# Altium schematic sheet MCU.SchDoc
size A3
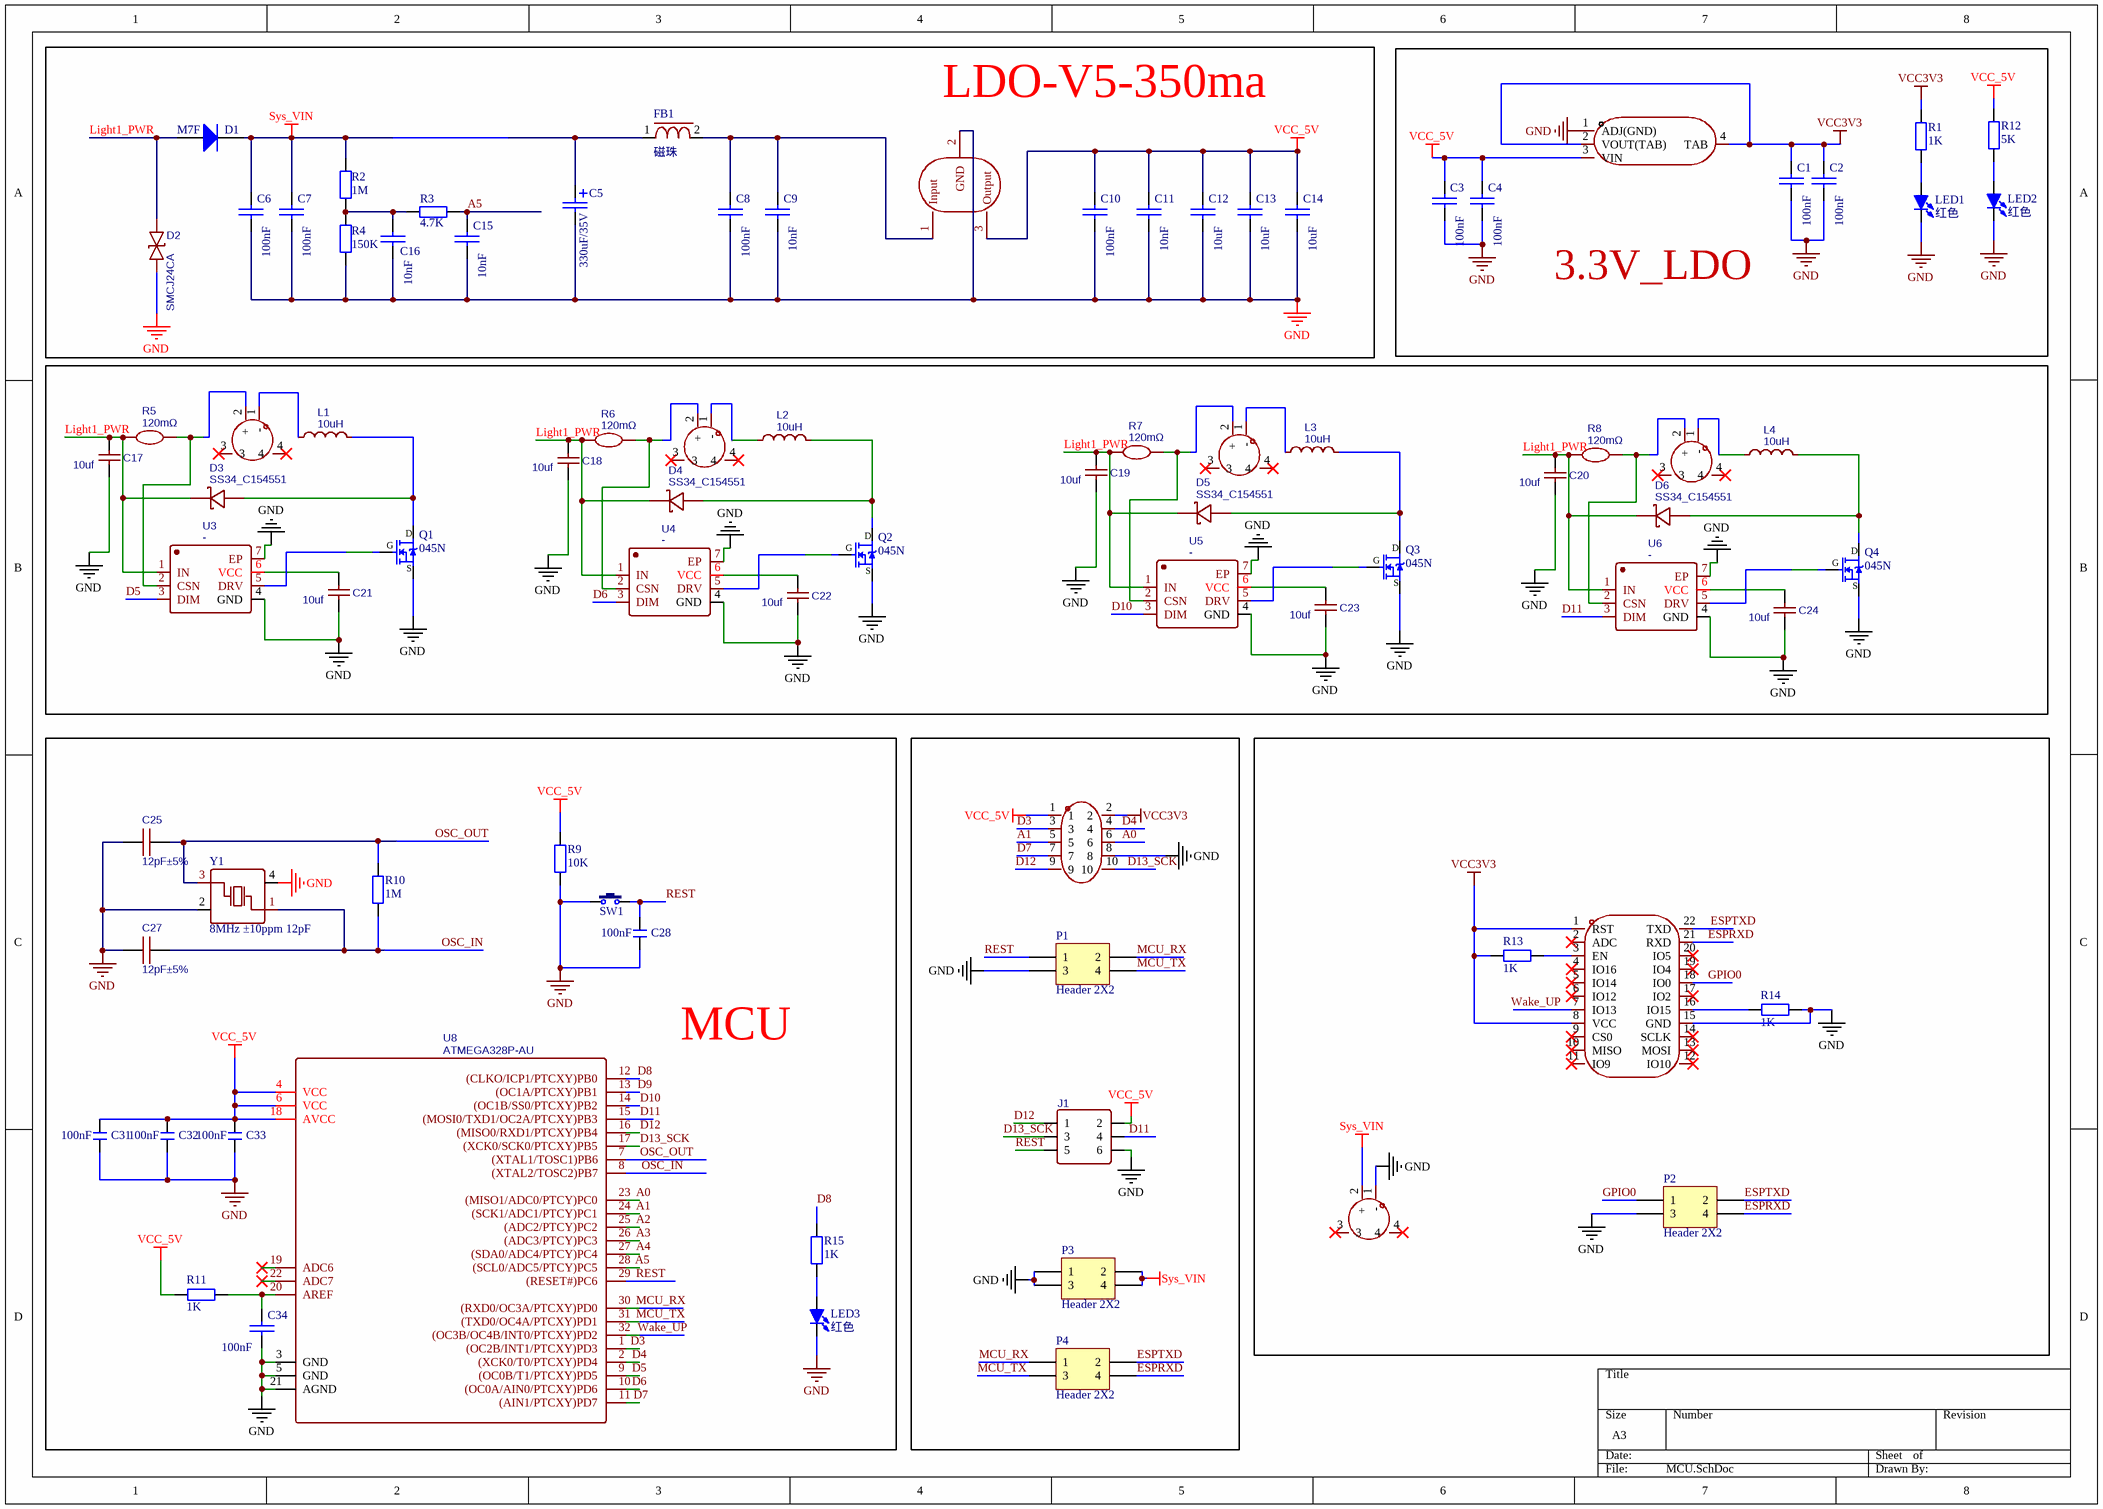
[diagram p0: MCU.SchDoc]

## Parts
C1  100nF  [C_0603]
C2  100nF  [C_0603]
C3  100nF  [C_0603]
C4  100nF  [C_0603]
C5  330uF/35V  [9*H11MM]
C6  100nF  [C_0603]
C7  100nF  [C_0603]
C8  100nF  [C_0603]
C9  10nF  [C_0603]
C10  100nF  [C_0603]
C11  10nF  [C_0603]
C12  10uF  [C_1206]
C13  10uF  [C_1206]
C14  10uF  [C_1206]
C15  10nF  [C_0603]
C16  10nF  [C_0603]
C17  10uf  [C_0603]
C18  10uf  [C_0603]
C19  10uf  [C_0603]
C20  10uf  [C_0603]
C21  10uf  [C_0603]
C22  10uf  [C_0603]
C23  10uf  [C_0603]
C24  10uf  [C_0603]
C25  12pF±5%  [C_0603]
C27  12pF±5%  [C_0603]
C28  100nF  [C_0603]
C31  100nF  [C_0603]
C32  100nF  [C_0603]
C33  100nF  [C_0603]
C34  100nF  [C_0603]
CN1  XT60PW-M  [CONN-TH_XT60PW-M - duplicate]  (value not drawn)
CN2  XT60PW-M  [CONN-TH_XT60PW-M - duplicate]  (value not drawn)
CN3  XT60PW-M  [CONN-TH_XT60PW-M - duplicate]  (value not drawn)
CN4  XT60PW-M  [CONN-TH_XT60PW-M - duplicate]  (value not drawn)
CN5  JL15EDGRHC-35005B02  [CONN-TH_5P-P3.50_JILN_JL15EDGRHC-35005B02]  (value not drawn)
CN6  XT60PW-M  [CONN-TH_XT60PW-M - duplicate]  (value not drawn)
D1  M7F  [SMA]
D2  SMCJ24CA  [SMC]
D3  SS34_C154551  [SMC]
D4  SS34_C154551  [SMC]
D5  SS34_C154551  [SMC]
D6  SS34_C154551  [SMC]
FB1  磁珠  [R_0805]
J1  HDR-M-2.54_2x3  [HDR-3X2]  (value not drawn)
L1  10uH  [IND-SMD_L7.0-W6.6_FXL0650]
L2  10uH  [IND-SMD_L7.0-W6.6_FXL0650]
L3  10uH  [IND-SMD_L7.0-W6.6_FXL0650]
L4  10uH  [IND-SMD_L7.0-W6.6_FXL0650]
LED1  红色  [LED 0805G]
LED2  红色  [LED 0805G]
LED3  红色  [LED 0805G]
P1  Header 2X2  [HDR-2X2]
P2  Header 2X2  [HDR-2X2]
P3  Header 2X2  [HDR-2X2]
P4  Header 2X2  [HDR-2X2]
Q1  045N  [TDSON-8_L5.9-W5.2-P1.27-BL]
Q2  045N  [TDSON-8_L5.9-W5.2-P1.27-BL]
Q3  045N  [TDSON-8_L5.9-W5.2-P1.27-BL]
Q4  045N  [TDSON-8_L5.9-W5.2-P1.27-BL]
R1  1K  [R_0603]
R2  1M  [R_0603]
R3  4.7K  [R_0603]
R4  150K  [R_0603]
R5  120mΩ  [R 2512-HP]
R6  120mΩ  [R 2512-HP]
R7  120mΩ  [R 2512-HP]
R8  120mΩ  [R 2512-HP]
R9  10K  [R_0603]
R10  1M  [R_0603]
R11  1K  [R_0603]
R12  5K  [R_0603]
R13  1K  [R_0603]
R14  1K  [R_0603]
R15  1K  [R_0603]
SW1  3x6x5  [TSW SMD-3*6*2.5]  (value not drawn)
U1  AMS1117-3.3  [SOT223_L]  (value not drawn)
U2  DIA7875B50TA3  [SOT223_N]  (value not drawn)
U3  -  [TDFN-6_L3.0-W3.0-P0.95-BL-EP]
U4  -  [TDFN-6_L3.0-W3.0-P0.95-BL-EP]
U5  -  [TDFN-6_L3.0-W3.0-P0.95-BL-EP]
U6  -  [TDFN-6_L3.0-W3.0-P0.95-BL-EP]
U7  2.4GHz  [WIRELM-SMD_ESP-12F]  (value not drawn)
U8  ATMEGA328P-AU  [TQFP-32_L7.0-W7.0-P0.80-LS9.0-BL]
Y1  8MHz ±10ppm 12pF  [SMD-3225-4P]

## Blocks framed on the sheet
LDO-V5-350ma: C5-C16 D1 D2 FB1 R2-R4 U2
3.3V_LDO: C1-C4 LED1 LED2 R1 R12 U1
MCU: C25 C27 C28 C31-C34 LED3 R9-R11 R15 SW1 U8 Y1

## Nets
GND: C1.2 C2.2 C3.2 C4.2 C5.2 C6.2 C7.2 C8.2 C9.2 C10.2 C11.2 C12.2 C13.2 C14.2 C15.2 C16.2 C17.1 C18.1 C19.1 C20.1 C21.1 C22.1 C23.1 C24.1 C25.1(A) C27.1(A) C28.1 C31.1 C32.1 C33.1 C34.2 CN5.8 CN6.1(-) D2.2 J1.6 LED1.2(K) LED2.2(K) LED3.2(K) P1.3 P2.3 P3.1 P3.3 Q1.3(D) Q2.3(D) Q3.3(D) Q4.3(D) R4.1 R9.1 R14.1 SW1.1 U1.1(ADJ(GND)) U2.2(GND) U3.4(GND) U3.7(EP) U4.4(GND) U4.7(EP) U5.4(GND) U5.7(EP) U6.4(GND) U6.7(EP) U7.15(GND) U8.3(GND) U8.5(GND) U8.21(AGND) Y1.2(GND) Y1.4(GND)
Sys_VIN: C5.1 C6.1 C7.1 CN6.2(+) D1.2(K) FB1.1 P3.2 P3.4 R2.2
VCC3V3: C1.1 C2.1 CN5.2 R1.2 R13.2 U1.2(VOUT(TAB)) U1.4(TAB) U7.1(RST) U7.8(VCC)
VCC_5V: C3.1 C4.1 C10.1 C11.1 C12.1 C13.1 C14.1 C31.2 C32.2 C33.2 CN5.1 J1.2 R9.2 R11.2 R12.2 U1.3(VIN) U2.3(Output) U8.4(VCC) U8.6(VCC) U8.18(AVCC)
A0: CN5.6 U8.23((MISO1/ADC0/PTCY)PC0)
A1: CN5.5 U8.24((SCK1/ADC1/PTCY)PC1)
A2: U8.25((ADC2/PTCY)PC2)
A3: U8.26((ADC3/PTCY)PC3)
A4: U8.27((SDA0/ADC4/PTCY)PC4)
A5: C15.1 R3.1 U8.28((SCL0/ADC5/PTCY)PC5)
D3: CN5.3 U8.1((OC2B/INT1/PTCXY)PD3)
D4: CN5.4 U8.2((XCK0/T0/PTCXY)PD4)
D5: U3.3(DIM) U8.9((OC0B/T1/PTCXY)PD5)
D6: U4.3(DIM) U8.10((OC0A/AIN0/PTCXY)PD6)
D7: CN5.7 U8.11((AIN1/PTCXY)PD7)
D8: R15.2 U8.12((CLKO/ICP1/PTCXY)PB0)
D9: U8.13((OC1A/PTCXY)PB1)
D10: U5.3(DIM) U8.14((OC1B/SS0/PTCXY)PB2)
D11: J1.4 U6.3(DIM) U8.15((MOSI0/TXD1/OC2A/PTCXY)PB3)
D12: CN5.9 J1.1 U8.16((MISO0/RXD1/PTCXY)PB4)
D13_SCK: CN5.10 J1.3 U8.17((XCK0/SCK0/PTCXY)PB5)
ESPRXD: P2.4 P4.4 U7.21(RXD)
ESPTXD: P2.2 P4.2 U7.22(TXD)
GPIO0: P2.1 U7.18(IO0)
Light1_PWR: C17.2 C18.2 C19.2 C20.2 D1.1(A) D2.1 D3.1(C) D4.1(C) D5.1(C) D6.1(C) R5.1 R6.1 R7.1 R8.1 U3.1(IN) U4.1(IN) U5.1(IN) U6.1(IN)
MCU_RX: P1.2 P4.1 U8.30((RXD0/OC3A/PTCXY)PD0)
MCU_TX: P1.4 P4.3 U8.31((TXD0/OC4A/PTCXY)PD1)
OSC_IN: C27.2(K) R10.1 U8.8((XTAL2/TOSC2)PB7) Y1.1(OSC1)
OSC_OUT: C25.2(K) R10.2 U8.7((XTAL1/TOSC1)PB6) Y1.3(OSC2)
REST: C28.2 J1.5 P1.1 SW1.2 U8.29((RESET#)PC6)
Wake_UP: U8.32((OC3B/OC4B/INT0/PTCXY)PD2)
NetC8_1: C8.1 C9.1 FB1.2 U2.1(Input)
NetC16_1: C16.1 R2.1 R3.2 R4.2
NetC21_2: C21.2 U3.6(VCC)
NetC22_2: C22.2 U4.6(VCC)
NetC23_2: C23.2 U5.6(VCC)
NetC24_2: C24.2 U6.6(VCC)
NetC34_1: C34.1 R11.1 U8.20(AREF)
NetCN1_1: CN1.1(-) L1.1
NetCN1_2: CN1.2(+) R5.2 U3.2(CSN)
NetCN2_1: CN2.1(-) L2.1
NetCN2_2: CN2.2(+) R6.2 U4.2(CSN)
NetCN3_1: CN3.1(-) L3.1
NetCN3_2: CN3.2(+) R7.2 U5.2(CSN)
NetCN4_1: CN4.1(-) L4.1
NetCN4_2: CN4.2(+) R8.2 U6.2(CSN)
NetD3_2: D3.2(A) L1.2 Q1.2(S)
NetD4_2: D4.2(A) L2.2 Q2.2(S)
NetD5_2: D5.2(A) L3.2 Q3.2(S)
NetD6_2: D6.2(A) L4.2 Q4.2(S)
NetLED1_1: LED1.1(A) R1.1
NetLED2_1: LED2.1(A) R12.1
NetLED3_1: LED3.1(A) R15.1
NetQ1_1: Q1.1(G) U3.5(DRV)
NetQ2_1: Q2.1(G) U4.5(DRV)
NetQ3_1: Q3.1(G) U5.5(DRV)
NetQ4_1: Q4.1(G) U6.5(DRV)
NetR13_1: R13.1 U7.3(EN)
NetR14_2: R14.2 U7.16(IO15)

Not connected (* = marked no-connect by the designer): CN1 3* 4*; CN2 3* 4*; CN3 3* 4*; CN4 3* 4*; CN6 3* 4*; U7 2(ADC)* 4(IO16)* 5(IO14)* 6(IO12)* 7(IO13) 9(CS0)* 10(MISO)* 11(IO9)* 12(IO10)* 13(MOSI)* 14(SCLK)* 17(IO2)* 19(IO4)* 20(IO5)*; U8 19(ADC6)* 22(ADC7)*

## Notes on the sheet
- Labels drawn without touching a wire or pin: Wake_UP

## Library data of the parts
C1-C4 C6-C16 C34 = C_
C5 = C_ELEC_330uF,35V,10.0x10.5,CAPXON: RV331M035G105ETR，贴片电解，330u/35V/±20%/10X10.5; pin to pad: 1>2 2>1
C17-C24 = 10uf: Manufacturer: muRata(村田); Manufacturer Part: GCM188R70J225KE22D; nameAlias: Value; Supplier: LCSC; Supplier Part: C126582; JLCPCB Part Class: Extended Part; spicePre: C; spiceSymbolName: GCM188R70J225KE22D
C25 C27 = CAP: 电容; BOM_Manufacturer: STMicroelectronics; spicePre: C
C28 C31-C33 = C: 无极性贴片电容; 版权归属: 源创客; 材质: X7R; BOM名称: 无极性贴片电容; 学习资源: www.ooocke.com
CN1-CN4 CN6 = XT60PW-M: Manufacturer: AMASS(艾迈斯); Add into BOM: yes; Brand: 艾迈斯; InterfaceType: 公头; Symbol: XT60PW-M; Device: XT60PW-M; LCSC Part Name: AMASS(艾迈斯)航模插头xt60连接器150公母对接pw锂电池公头 板插卧式XT60PW-M; Supplier Part: C98732; Manufacturer Part: XT60PW-M; Supplier Footprint: -; JLCPCB Part Class: Extended Part; Datasheet: https://atta.szlcsc.com/upload/public/pdf/source/20240118/44A3DCFF53BE25DC65378AFFB21277A4.pdf; Supplier: LCSC; Convert to PCB: yes; Model: XT60PW-M; Power: -; Output: -; Input: -; Size: -; Interface: -; Type: 卧式插头; Colour: 黄色; MaximumCurrent: -; RatedVoltage: -; Type1: -; NumberOfUSBHoles: -; MetalMaterial: -; InsulationMaterial: -; RatedCurrent: -; RecommendedWireGauge: -; FlameRetardantGrade: -; contact resistance: -; Belt length: -; specifications: -
CN5 = JL15EDGRHC-35005B02: Manufacturer: JILN(锦凌); Add into BOM: yes; Connector Type: 板端/插座-闭口; Structure: 2x5P; Pitch: 3.5mm; Number of PINs Per Row: 5; Current Rating (Max): 8A; Voltage Rating (Max): 300V; Symbol: JL15EDGRHC-35005B02; Device: JL15EDGRHC-35005B02; LCSC Part Name: 2x5P 3.5mm 排数:2 每排P数:5; Supplier Part: C2908411; Manufacturer Part: JL15EDGRHC-35005B02; Supplier Footprint: 弯插,P=3.5mm; JLCPCB Part Class: Extended Part; Datasheet: https://atta.szlcsc.com/upload/public/pdf/source/20211026/0700CF8471C3BB652331673F467DA963.pdf; Supplier: LCSC; Convert to PCB: yes; Color: 黑色; Mounting Style: 弯针; Number of Pins: 10P; Number of Rows: 2; Contact Material: 铜; Contact Plating: 锡; Operating Temperature Range: -40℃~+150℃; Soldering Temperature(Max): -
D1 = D_M7F,SMAF,MCC: M7F,二极管/1000V/1A/1.1V/SMAF/-55oC~150oC
D2 = SMBJ15CA: BOM_Manufacturer: Jingdao; Contributor: LCSC; BOM_Supplier Part: C169449; BOM_Supplier: LCSC; BOM_Manufacturer Part: SMBJ15CA; BOM_JLCPCB Part Class: Extended Part; spicePre: D; spiceSymbolName: SMBJ15CA
D3-D6 = SS34_C154551: Manufacturer: onsemi(安森美); Manufacturer Part: SS34; Contributor: LCSC; Supplier Part: C154551; Supplier: LCSC; spicePre: D; spiceSymbolName: SS34_C154551
FB1 = 磁珠: UPB201209T-101Y-N,磁珠/100Ω/5A/0805,奇力新
J1 = HDR-M-2.54_2x3: Contributor: LCEDA_Lib; BOM_Supplier Part: C65114; BOM_Supplier: LCSC; spicePre: J; spiceSymbolName: HDR-M-2.54_2x3
L1-L4 = 10uH: Manufacturer: cjiang(长江微电); Manufacturer Part: FXL0650-8R2-M; nameAlias: Value; Contributor: LCSC; Supplier: LCSC; Supplier Part: C475529; JLCPCB Part Class: Extended Part; spicePre: L; spiceSymbolName: FXL0650-8R2-M
LED1-LED3 = LED-SMD: 贴片LED; 版权归属: 源创客; BOM名称: 贴片LED; 学习资源: www.ooocke.com
P1-P4 = Header 2X2: Header, 2-Pin, Dual row; LatestRevisionDate: 17-Jul-2002; LatestRevisionNote: Re-released for DXP Platform.; Publisher: Altium Limited
Q1-Q4 = 10N65: CRSM045N04N2Z; BOM名称: 场效应管; 版权归属: 源创客; 描述: N沟道  650V/10A; 学习资源: www.ooocke.com
R1 R9-R15 = RX: 大功率电阻; 版权归属: 源创客; BOM名称: 大功率电阻; 学习资源: www.ooocke.com
R2-R4 = R_: 贴片电阻
R5-R8 = 120mΩ: Manufacturer: Milliohm(毫欧); Manufacturer Part: HoJLR2512-3W-120mR-1%; nameAlias: Value; Contributor: lcsc; Supplier: LCSC; Supplier Part: C2904255; spicePre: R; spiceSymbolName: HOJLR2512-3W-120MR-1%
SW1 = TSW 3x6: 3x6轻触开关; 版权归属: 源创客; BOM名称: 3x6轻触开关; 学习资源: www.ooocke.com
U1 = AMS1117-3.3_C347222: pin to pad: 4>2; Manufacturer: UMW(友台半导体); Add into BOM: yes; Output Type: 固定; Voltage - Supply: 12V; Output Voltage: 3.3V; Output Current: 1A; Power Supply Rejection Ratio (PSRR): 60dB@(120Hz); Voltage Dropout: 1.3V@(1A); Output Configuration: 正极; Number of Outputs: 1; Symbol: AMS1117-3.3_C347222; Device: AMS1117-3.3_C347222; LCSC Part Name: 输出:3.3V 电流:1A 耐压:12V; Supplier Part: C347222; Manufacturer Part: AMS1117-3.3; Supplier Footprint: SOT-223; JLCPCB Part Class: Extended Part; Datasheet: https://atta.szlcsc.com/upload/public/pdf/source/20241218/BAF0263FA2E44BCD8AF41AA4FA04EFAA.pdf; Supplier: LCSC; Convert to PCB: yes; standby current: -; Noise: -; Features: 过流保护; Operating Temperature: -
U2 = DIA7875
U3-U6 = -: Manufacturer: ADI(亚德诺)/MAXIM(美信); Manufacturer Part: MAX16819ATT+T; Contributor: LCSC; nameAlias: Value; Supplier: LCSC; Supplier Part: C143371; JLCPCB Part Class: Extended Part; spicePre: U; spiceSymbolName: MAX16819ATT+T
U7 = ESP-12F: Manufacturer: DOIT(四博智联); Add into BOM: yes; Wireless Standard: WIFI4; Support Interface: IO；UART; Antenna Type: PCB; Output Power: 15dBm; Operating Voltage: 3.3V; Receive  Current: 55mA; Send  Current: 375mA; Sensitivity: -96dBm; Symbol: ESP-12F; Device: ESP-12F; LCSC Part Name: ESP8266 WiFi模组,32Mbit Flash, 通用模组; Supplier Part: C19949064; Manufacturer Part: ESP-12F; Supplier Footprint: SMD,24x16mm; JLCPCB Part Class: Extended Part; Datasheet: https://atta.szlcsc.com/upload/public/pdf/source/20240112/4C731B83AC84B82D8ABE33233BB0FED4.pdf; Supplier: LCSC; Convert to PCB: yes; Value: 2.4GHz; Operating Temperature: -40℃~+85℃
U8 = ATMEGA328P-AU: BOM_Manufacturer: MICROCHIP; Contributor: 13471635540; SMT Type: Extend; BOM_Supplier: LCSC; BOM_Manufacturer Part: ATMEGA328P-AU; BOM_Supplier Part: C14877; BOM_LCSC Assembly: Yes; spicePre: U; spiceSymbolName: ATMEGA328P-AU
Y1 = 晶振4P